# EAGLE design Qwiic_Weather (EAGLE 9.4.2)
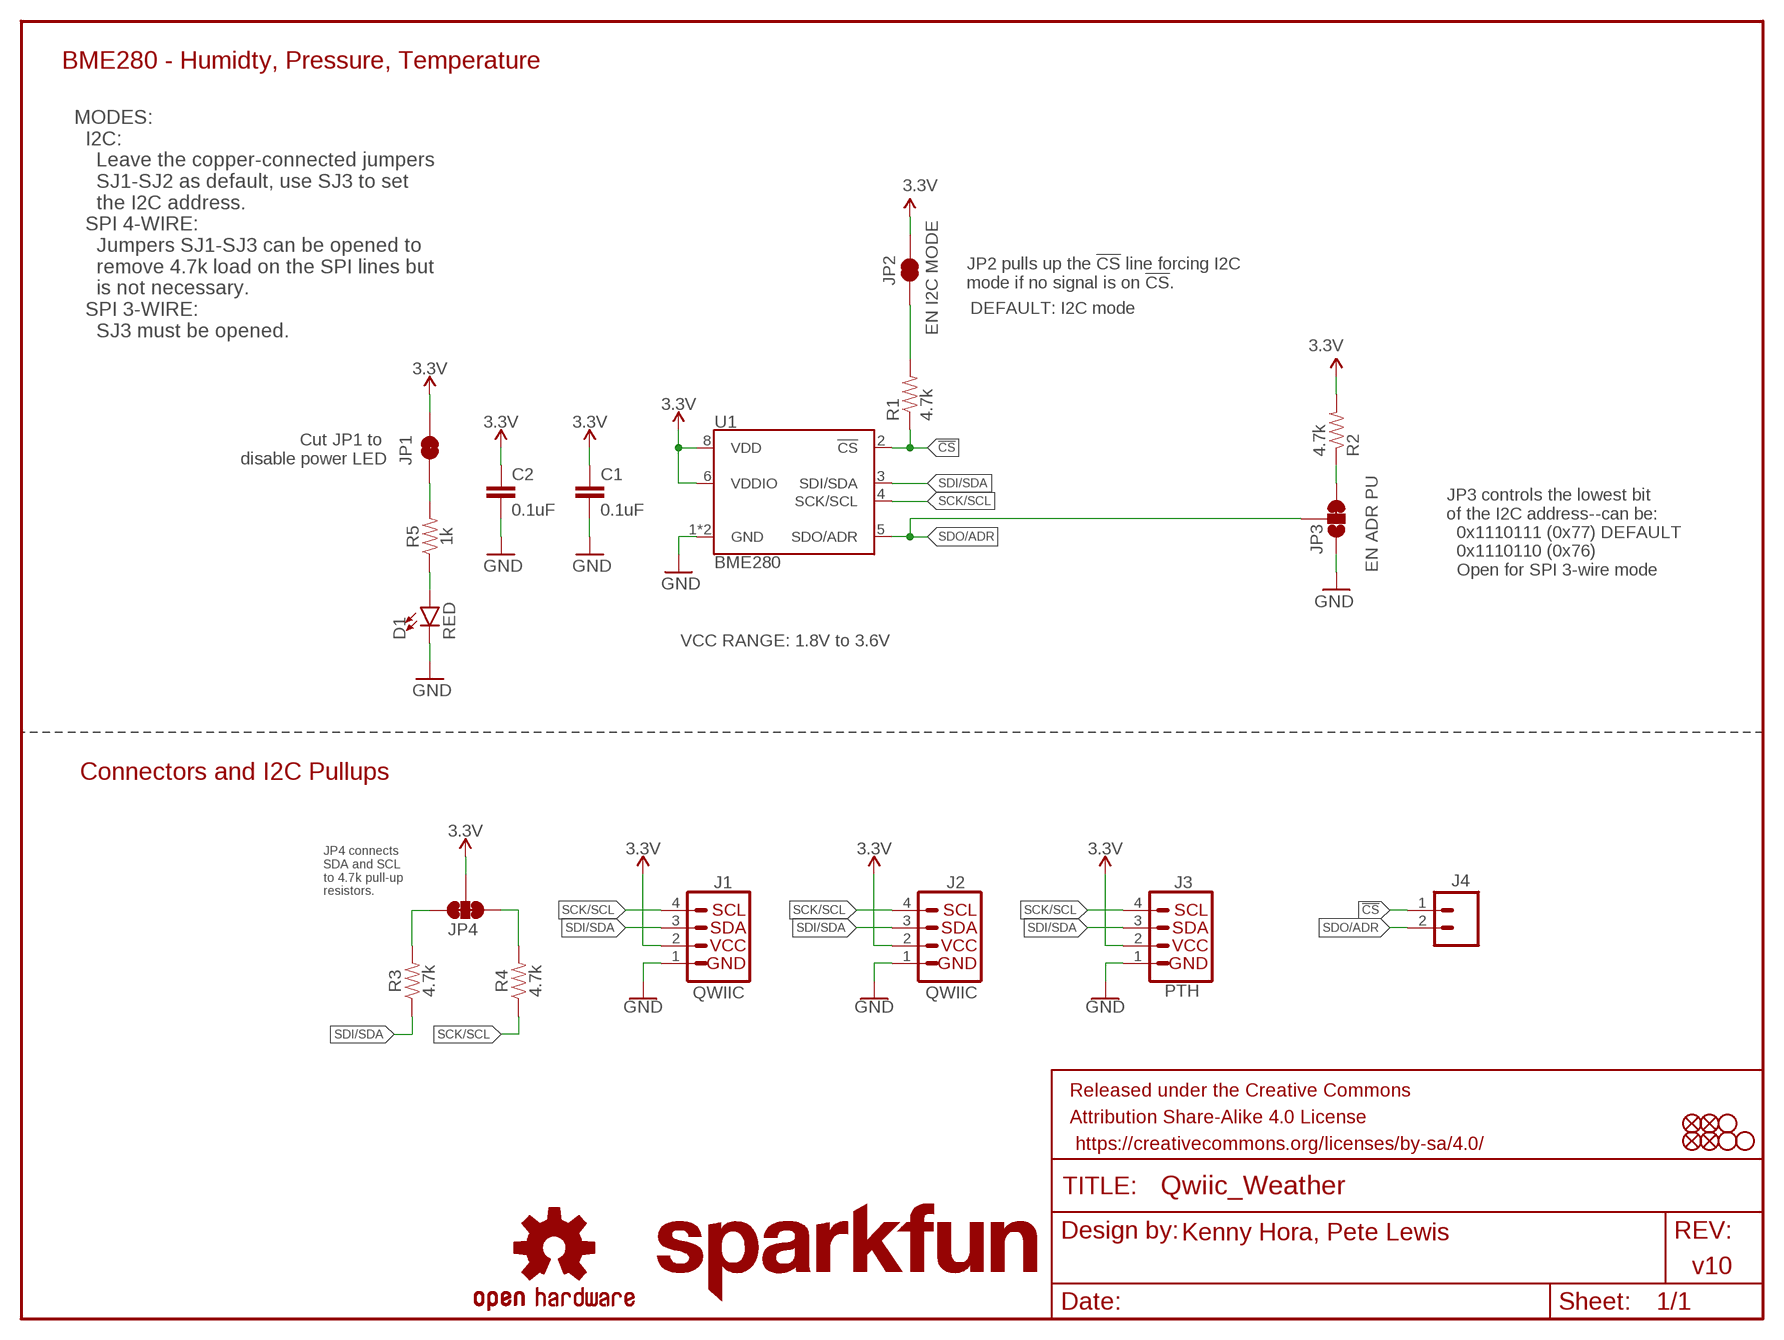
[diagram p0: schematic, sheet 1]

## Parts
C1  0.1uF  0.1UF-0603-25V-(+80/-20%)  [0603]
C2  0.1uF  0.1UF-0603-25V-(+80/-20%)  [0603]
D1  RED  LED-RED0603  [LED-0603]
FD1  FIDUCIAL1X2  [FIDUCIAL-1X2]
FD2  FIDUCIAL1X2  [FIDUCIAL-1X2]
FD3  FIDUCIAL1X2  [FIDUCIAL-1X2]
FD4  FIDUCIAL1X2  [FIDUCIAL-1X2]
FRAME1  FRAME-LETTER  [CREATIVE_COMMONS]
H1  STAND-OFF  [STAND-OFF]
H2  STAND-OFF  [STAND-OFF]
H4  STAND-OFF  [STAND-OFF]
J1  QWIIC  I2C_STANDARDQWIIC  [JST04_1MM_RA]
J2  QWIIC  I2C_STANDARDQWIIC  [JST04_1MM_RA]
J3  PTH  I2C_STANDARD_NO_SILK  [1X04_NO_SILK]
J4  CONN_021X02_NO_SILK  [1X02_NO_SILK]
JP1  JUMPER-SMT_2_NC_TRACE_NO-SILK  [SMT-JUMPER_2_NC_TRACE_NO-SILK]
JP2  EN I2C MODE  JUMPER-PAD-2-NC_BY_TRACENO_SILK  [PAD-JUMPER-2-NC_BY_TRACE_NO_SILK]
JP3  EN ADR PU  JUMPER-SMT_3_1-NC_TRACE_NO-SILK  [SMT-JUMPER_3_1-NC_TRACE_NO-SILK]
JP4  JUMPER-SMT_3_2-NC_TRACE_NO-SILK  [SMT-JUMPER_3_2-NC_TRACE_NO-SILK]
LOGO1  SFE_LOGO_NAME.1_INCH  [SFE_LOGO_NAME_.1]
LOGO4  OSHW-LOGOS  [OSHW-LOGO-S]
R1  4.7k  4.7KOHM-0603-1/10W-1%  [0603]
R2  4.7k  4.7KOHM-0603-1/10W-1%  [0603]
R3  4.7k  4.7KOHM-0603-1/10W-1%  [0603]
R4  4.7k  4.7KOHM-0603-1/10W-1%  [0603]
R5  1k  1KOHM-0603-1/10W-1%  [0603]
U1  BME280  [LGA-8-2.5X2.5]

## Nets
3.3V: C1.1 C2.1 J1.2 J2.2 J3.2 JP1.2 JP2.2 JP4.2 R2.2 U1.6(VDDIO) U1.8(VDD)
!CS: J4.1 R1.1 U1.2(!CS)
GND: C1.2 C2.2 D1.C J1.1 J2.1 J3.1 JP3.1 U1.1(GND) U1.7(GND)
N$2: JP3.3 R2.1
N$3: D1.A R5.1
N$4: JP4.3 R3.2
N$5: JP4.1 R4.2
N$6: JP2.1 R1.2
N$7: JP1.1 R5.2
SCK/SCL: J1.4 J2.4 J3.4 R4.1 U1.4(SCK/SCL)
SDI/SDA: J1.3 J2.3 J3.3 R3.1 U1.3(SDI/SDA)
SDO/ADR: J4.2 JP3.2 U1.5(SDO/ADR)

## Notes on the sheet
- BME280 - Humidty, Pressure, Temperature
- MODES:
    I2C:
      Leave the copper-connected jumpers
      SJ1-SJ2 as default, use SJ3 to set
      the I2C address.
    SPI 4-WIRE:
      Jumpers SJ1-SJ3 can be opened to 
      remove 4.7k load on the SPI lines but
      is not necessary.
    SPI 3-WIRE:
      SJ3 must be opened.
- JP2 pulls up the !CS! line forcing I2C
  mode if no signal is on !CS!.
- DEFAULT: I2C mode
- Cut JP1 to 
  disable power LED
- JP3 controls the lowest bit
  of the I2C address--can be:
    0x1110111 (0x77) DEFAULT
    0x1110110 (0x76)
    Open for SPI 3-wire mode
- VCC RANGE: 1.8V to 3.6V
- Connectors and I2C Pullups
- JP4 connects 
  SDA and SCL 
  to 4.7k pull-up 
  resistors.
- Kenny Hora, Pete Lewis
- v10

## Library data of the parts
C1 C2 = SparkFun-Capacitors:0.1UF: 0.1µF ceramic capacitors A capacitor is a passive two-terminal electrical component used to store electrical energy temporarily in an electric field.; PROD_ID: CAP-00810
D1 = SparkFun-LED:LED-RED: Red SMD LED Used in manufacturing of most products at SparkFun Packages: 0603 - SMD 0603 package [Product Link] <http://docs.avagotech.com/docs/AV02-0551EN> 0603 SMART - SMD 0603 SMART package ( more efficient and expensive)[Product Link] <http://www.osram-os.com/Graphics/XPic2/00077099_0.pdf> 1206 - SMD1206 package [Product Link] <https://www.sparkfun.com/datasheets/DevTools/LilyPad/Q150OVS4.pdff> SparkFun Products: Pro Mini 328 -5V <https://www.sparkfun.com/products/821> RedBoard <https://www.sparkfun.com/products/12757> IOIO-OTG <https://www.sparkfun.com/products/13613>; PROD_ID: DIO-00819
FD1-FD4 = SparkFun-Aesthetics:FIDUCIAL: Fiducial Alignment Points Point-of-reference for pick-and-place machines and other optical instruments.
FRAME1 = SparkFun-Aesthetics:FRAME-LETTER: Schematic Frame - Letter Standard 8.5x11 US Letter frame
H1 H2 H4 = SparkFun-Hardware:STAND-OFF: Stand Off Drill holes for mechanically mounting via screws, standoffs, etc. Note: Use the keepout ring to avoid running the screw head into surrounding components. Variant Overviews STAND-OFF - Mechanical footprint for a #4 phillips button head screw. STAND-OFF-TIGHT - Mechanical footprint for a #4 phillips button head screw, Example SparkFun Products Screw - Phillips Head (1/4", 4-40, 10 pack) <https://www.sparkfun.com/products/10453> (PRT-10453) Screw - Phillips Head (1/2", 4-40, 10 pack) <https://www.sparkfun.com/products/10452> (PRT-10452) Screw - Phillips Head (3/4", 4-40, 10 pack) <https://www.sparkfun.com/products/10451> (PRT-10451) Screw - Phillips Head (1", 4-40, 10 pack) <https://www.sparkfun.com/products/10450> (PRT-10450)
J1 J2 = SparkFun-Connectors:I2C_STANDARD: SparkFun I2C Standard Pinout Header SparkFun has standardized on a pinout for all I2C based sensor breakouts. This pinout allows I2C boards to be plugged directly into the headers on Arduino Uno compatible boards, and to be daisy chained easily. Example SparkFun Products: SparkFun Atmospheric Sensor Breakout - BME280 <https://www.sparkfun.com/products/13676> SparkFun Altitude/Pressure Sensor Breakout - MPL3115A2 <https://www.sparkfun.com/products/11084> SparkFun TOF Range Finder Sensor - VL6180 <https://www.sparkfun.com/products/12785>; PROD_ID: CONN-13694; VALUE: Qwiic Right Angle
J3 = SparkFun-Connectors:I2C_STANDARD: SparkFun I2C Standard Pinout Header SparkFun has standardized on a pinout for all I2C based sensor breakouts. This pinout allows I2C boards to be plugged directly into the headers on Arduino Uno compatible boards, and to be daisy chained easily. Example SparkFun Products: SparkFun Atmospheric Sensor Breakout - BME280 <https://www.sparkfun.com/products/13676> SparkFun Altitude/Pressure Sensor Breakout - MPL3115A2 <https://www.sparkfun.com/products/11084> SparkFun TOF Range Finder Sensor - VL6180 <https://www.sparkfun.com/products/12785>
J4 = SparkFun-Connectors:CONN_02: Multi connection point. Often used as Generic Header-pin footprint for 0.1 inch spaced/style header connections On any of the 0.1 inch spaced packages, you can populate with these: Break Away Headers - Straight <https://www.sparkfun.com/products/116> (PRT-00116) Break Away Male Headers - Right Angle <https://www.sparkfun.com/products/553> (PRT-00553) Female Headers <https://www.sparkfun.com/products/115> (PRT-00115) Break Away Headers - Machine Pin <https://www.sparkfun.com/products/117> (PRT-00117) Break Away Female Headers - Swiss Machine Pin <https://www.sparkfun.com/products/743> (PRT-00743) For SCREWTERMINALS and SPRING TERMINALS visit here: Screw Terimnals on SparkFun.com <https://www.sparkfun.com/search/results?term=Screw+Terminals> (5mm/3.5mm/2.54mm spacing) This device is also useful as a general connection point to wire up your design to another part of your project. Our various solder wires solder well into these plated through hole pads. Hook-Up Wire - Assortment (Stranded, 22 AWG) <https://www.sparkfun.com/products/11375> (PRT-11375) Hook-Up Wire - Assortment (Solid Core, 22 AWG) <https://www.sparkfun.com/products/11367> (PRT-11367) View the entire wire category on our website here <https://www.sparkfun.com/categories/141> Special notes: Molex polarized connector foot print use with: PRT-08233 with associated crimp pins and housings. 2.54_SCREWTERM for use with PRT-10571. 3.5mm Screw Terminal footprints for PRT-08084 5mm Screw Terminal footprints for use with PRT-08432
JP1 = SparkFun-Jumpers:JUMPER-SMT_2_NC_TRACE: Normally closed trace jumper This jumper has a trace between two pads so it's normally closed (NC). Use a razor knife to open the connection. For best results follow the IPC guidelines for cutting traces: Cutout at least 0.063 mm (0.005 in). Remove all loose material to clean up the cut area. Seal the cut with an approved epoxy. Reapply solder to reclose the connection.
JP2 = SparkFun-Passives:JUMPER-PAD-2-NC_BY_TRACE
JP3 = SparkFun-Jumpers:JUMPER-SMT_3_1-NC_TRACE: Normally closed trace jumper (1 of 2 connections) This jumper has a trace between two pads so it's normally closed (NC). The other connection is normally open (NO). Use a razor knife to open the connection. For best results follow the IPC guidelines for cutting traces: Cutout at least 0.063 mm (0.005 in). Remove all loose material to clean up the cut area. Seal the cut with an approved epoxy. Reapply solder to reclose the connection, or to close the NO connection.
JP4 = SparkFun-Jumpers:JUMPER-SMT_3_2-NC_TRACE: Normally closed trace jumper (2 of 2 connections) This jumper has a trace between all three pads so they are normally closed (NC). Use a razor knife to open the connection(s). For best results follow the IPC guidelines for cutting traces: Cutout at least 0.063 mm (0.005 in). Remove all loose material to clean up the cut area. Seal the cut with an approved epoxy. Reapply solder to reclose the connection(s).
LOGO1 = SparkFun-Aesthetics:SFE_LOGO_NAME: SparkFun Font Logo This is the SparkFun name logo. The logo on the schematic will always be the same size; the package variant is the height of the flame part of the logo (or the height the flame would be, if it were drawn). Default layer for the logo on the board is tSilk.
LOGO4 = SparkFun-Aesthetics:OSHW-LOGO: Open-Source Hardware (OSHW) Logo This logo indicates the piece of hardware it is found on incorporates a OSHW license and/or adheres to the definition of open source hardware found here: http://freedomdefined.org/OSHW
R1-R4 = SparkFun-Resistors:4.7KOHM: 4.7kΩ resistor A resistor is a passive two-terminal electrical component that implements electrical resistance as a circuit element. Resistors act to reduce current flow, and, at the same time, act to lower voltage levels within circuits. - Wikipedia; PROD_ID: RES-07857
R5 = SparkFun-Resistors:1KOHM: 1kΩ resistor A resistor is a passive two-terminal electrical component that implements electrical resistance as a circuit element. Resistors act to reduce current flow, and, at the same time, act to lower voltage levels within circuits. - Wikipedia; PROD_ID: RES-07856
U1 = SparkFun-Sensors:BME280: Bosch BME280 – Combined Humidity and Pressure Sensor The BME280 is as combined digital humidity, pressure and temperature sensor based on proven sensing principles. The sensor module is housed in an extremely compact metal-lid LGA package with a footprint of only 2.5×2.5mm² with a height of 0.93mm. Its small dimensions and its low power consumption allow the implementation in battery driven devices such as handsets, GPS modules or watches. Datasheet <https://cdn.sparkfun.com/assets/learn_tutorials/4/1/9/BST-BME280_DS001-10.pdf> SparkFun Products SparkFun Atmospheric Sensor Breakout - BME280 <https://www.sparkfun.com/products/13676> (SEN-13676); PROD_ID: IC-13090

## Board
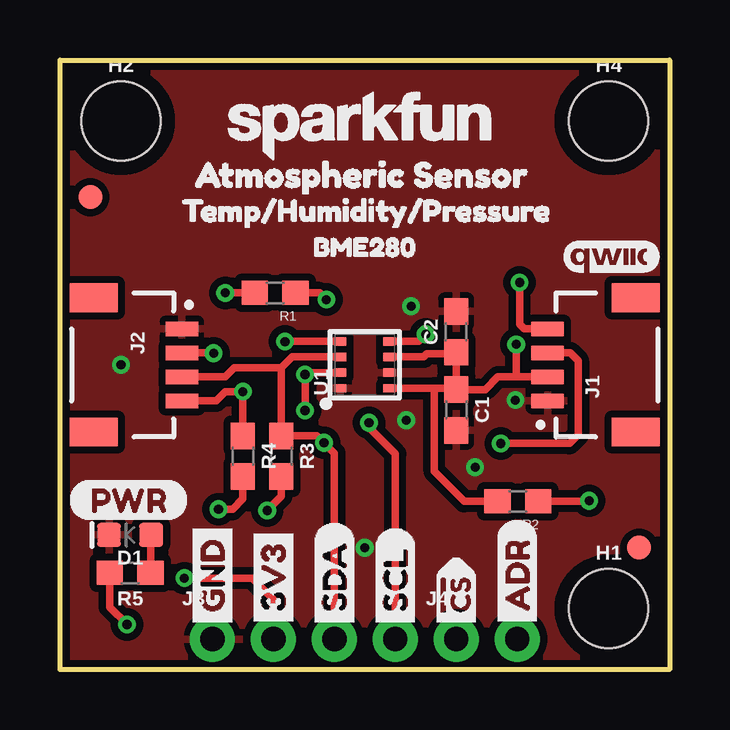
[diagram p1: board, top side]
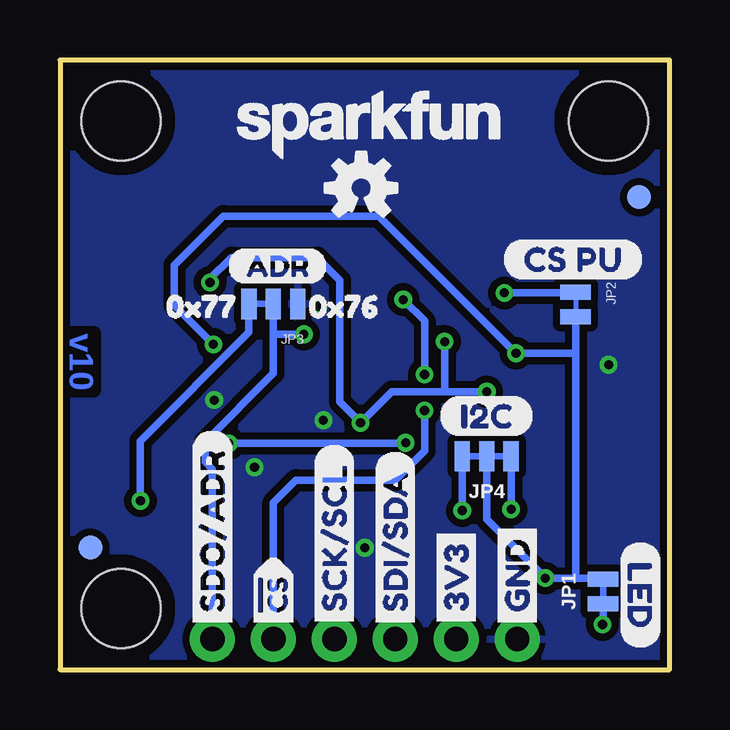
[diagram p2: board, bottom side, seen from below]

Size 25.4 x 25.4 mm. Coordinates in mm from the lower left corner, seen from the top.
Outline: 0,0 0,25.4 25.4,25.4 25.4,0 0,0
Copper layers (1*16): Top 0.035mm / dielectric 1.5mm / Bottom 0.035mm
Design rules "SparkFun-2-layer-TIGHT": minimum track width 7mil, minimum drill 15mil, track to track 7mil, track to pad 7mil, pad to pad 7mil, via to via 7mil, smd to smd 7mil, copper to edge 7mil, drill to drill 7mil, minimum pad ring 7mil, minimum via ring 7mil, stop-mask expansion 4mil, vias tented up to drill 25mil, thermal gap 10mil

### Footprints (pad centres in the part's own frame; a part is rotated, then mirrored left to right if it is on the bottom)
0603 = smd 1.1 x 1: 1 -0.85,0; 2 0.85,0
LED-0603 = smd 1 x 1: A -0.877,0; C 0.877,0
FIDUCIAL-1X2 = smd 1 x 1: 1 0,0
STAND-OFF = hole 3.302: 0,0
JST04_1MM_RA = smd 0.6 x 1.35: 1 -1.5,0; 2 -0.5,0; 3 0.5,0; 4 1.5,0 | smd 1.2 x 2: NC1 2.8,-3.675; NC2 -2.8,-3.675
1X04_NO_SILK = drill 1.016 pad 1.88: 1 0,0; 2 2.54,0; 3 5.08,0; 4 7.62,0
1X02_NO_SILK = drill 1.016 pad 1.88: 1 0,0; 2 2.54,0
SMT-JUMPER_2_NC_TRACE_NO-SILK = smd 0.635 x 1.27: 1 -0.508,0; 2 0.508,0
PAD-JUMPER-2-NC_BY_TRACE_NO_SILK = smd 0.635 x 1.27: 1 -0.508,0; 2 0.508,0
SMT-JUMPER_3_1-NC_TRACE_NO-SILK = smd 0.635 x 1.27: 1 -1.016,0; 2 0,0; 3 1.016,0
SMT-JUMPER_3_2-NC_TRACE_NO-SILK = smd 0.635 x 1.27: 1 -1.016,0; 2 0,0; 3 1.016,0
LGA-8-2.5X2.5 = smd 0.35 x 0.5: 1 -0.975,1.025; 2 -0.325,1.025; 3 0.325,1.025; 4 0.975,1.025; 5 0.975,-1.025; 6 0.325,-1.025; 7 -0.325,-1.025; 8 -0.975,-1.025

### Placement (x,y rotation side)
C1  16.51,10.82 270 top
C2  16.51,14.07 90 top
D1  2.92,5.61 180 top
FD1  1.27,19.68 0 top
FD2  24.13,5.08 0 top
FD3  24.13,5.08 0 bottom
FD4  1.27,19.68 0 bottom
FRAME1  -13.97,-21.59 0 top  (outside the outline)
H1  22.86,2.54 0 top
H2  2.54,22.86 0 top
H4  22.86,22.86 0 top
J1  20.32,12.7 90 top
J2  5.08,12.7 270 top
J3  6.35,1.27 0 top
J4  16.51,1.27 0 top
JP1  2.77,3.25 90 bottom
JP2  3.91,15.21 270 bottom
JP3  16.51,15.24 180 bottom
JP4  7.62,8.89 180 bottom
LOGO1  12.5,22.65 0 top
LOGO3  SFE_LOGO_NAME.1_INCH  [SFE_LOGO_NAME_.1@1]  18.49,20.8 0 bottom
LOGO4  12.85,20.07 0 bottom
R1  8.97,15.7 180 top
R2  19.08,7.01 180 top
R3  9.22,8.89 270 top
R4  7.62,8.89 270 top
R5  2.92,4.04 180 top
U1  12.7,12.7 90 top
U$1  [LED0]  1.22,5.41 270 bottom
U$2  [3V34]  8.89,1.5 90 top
U$3  [ADR8]  19.05,1.5 90 top
U$4  [GND3]  6.35,1.5 90 top
U$5  [SDA5]  11.43,1.5 90 top
U$6  [SCL6]  13.97,1.5 90 top
U$7  [3V34]  8.89,1.5 90 bottom
U$8  [GND3]  6.35,1.5 90 bottom
U$9  [SDI#SDA11]  11.43,1.5 90 bottom
U$10  [SDO#ADR9]  19.05,1.5 90 bottom
U$11  [SCK#SCL10]  13.97,1.5 90 bottom
U$13  [PWR0]  0.36,7.06 0 top
U$14  [#CS0]  16.51,1.3 90 top
U$15  [BME2804]  9.88,17.6 0 top
U$16  [QWIIC_4MM]  22.99,17.2 0 top
U$17  [ATMOSPHERIC_SENSOR0]  4.72,20.62 0 top
U$18  [ADR2]  18.47,16.81 0 bottom
U$19  [0X771]  21.77,15.14 0 bottom
U$20  [0X760]  15.82,15.14 0 bottom
U$21  [CS_PU1]  7.01,17.09 0 bottom
U$22  [I2C0]  9.65,10.57 0 bottom
U$23  [TEMP#HUMIDITY#PRESSURE0]  4.29,19.13 0 top
U$24  [#CS0]  16.51,1.3 90 bottom

### Tracks (layer width: path | path; a pad name or v marks a point on that pad's centre or on a via)
3.3V  (via drill 0.38)
  Top 0.305: 19.02,12.2 18.25,12.2 17.72,11.67 C1.1 | 19.02,12.2 J1.2 | U1.6 15.16,13.03 15.29,13.16 16.45,13.16 C2.1 C1.1 | v5.18,3.81 8,3.81 8.89,2.92 J3.2 | 15.6,11.72 16.45,11.72 C1.1 | R2.2 16.84,7.01 15.6,8.26 15.6,11.72 | v19.01,13.55 19.01,12.21 19.02,12.2 | J2.2 6.38,13.2 v6.4,13.18 | U1.8 15.6,11.72
  Bottom 0.305: v19.01,13.55 20.64,15.18 20.64,16.85 18.59,18.9 12.12,18.9 v6.4,13.18 3.91,13.18 | JP2.2 3.91,13.18 | JP4.2 7.62,6.27 5.18,3.83 v5.18,3.81 3.91,3.81 | 3.91,3.81 2.82,3.81 JP1.2 | 3.91,13.18 3.91,3.81
!CS  (via drill 0.38)
  Top 0.305: U1.2 10.29,12.38 v10.21,12.29 v10.21,10.79 | R1.1 10.82,15.7 v11.1,15.42
  Bottom 0.305: v10.21,12.29 10.21,14.53 v11.1,15.42 | J4.1 16.51,6.96 15.57,7.9 11.43,7.9 10.21,9.12 v10.21,10.79
GND  (via drill 0.38)
  other vias: 12.7,5.08 18.97,11.23 14.63,15.14 2.54,12.7 14.43,10.39 17.3,8.43
  pour Top (isolate 0.305): 0,0 25.4,0 25.4,25.4 0,25.4
  pour Bottom (isolate 0.305): 0,25.4 25.4,25.4 25.4,0 0,0
N$2  (via drill 0.38)
  Top 0.305: v22.05,7.04 22.02,7.01 R2.1
  Bottom 0.305: v22.05,7.04 22.05,9.53 17.53,14.05 JP3.3
N$3
  Top 0.305: R5.1 3.77,5.59 D1.A
N$4  (via drill 0.38)
  Top 0.305: R3.2 9.22,7.21 v8.64,6.63
  Bottom 0.305: JP4.3 v8.64,6.63
N$5  (via drill 0.38)
  Top 0.305: R4.2 7.62,7.11 7.19,6.68 v6.6,6.68
  Bottom 0.305: JP4.1 v6.6,6.68
N$6  (via drill 0.38)
  Top 0.305: R1.2 v6.88,15.7
  Bottom 0.305: JP2.1 3.94,15.7 v6.88,15.7
N$7  (via drill 0.38)
  Top 0.305: v2.79,1.88 2.07,2.6 R5.2
  Bottom 0.305: JP1.1 2.77,1.91 v2.79,1.88
SCK/SCL  (via drill 0.38)
  Top 0.305: J2.4 6.5,11.2 6.88,11.58 v7.62,11.58 R4.1 | U1.4 9.38,13.68 v9.37,13.66 | J3.4 13.97,8.99 12.88,10.08 v12.88,10.29 | J1.4 19.35,14.2 19.15,14.4 v19.15,16.13
  Bottom 0.305: v19.15,16.13 19.15,16.28 18.26,17.17 14.68,17.17 13.74,16.23 13.74,11.15 v12.88,10.29 11.58,11.58 9.35,11.58 | v7.62,11.58 9.35,11.58 | v9.37,13.66 9.37,11.61 9.35,11.58
SDI/SDA  (via drill 0.38)
  Top 0.305: J3.3 11.43,9.02 v11,9.45 10.71,9.74 R3.1 9.22,12.58 | J1.3 21.27,13.2 21.59,12.88 21.59,9.78 21.23,9.42 v18.36,9.42 | J2.3 6.89,12.2 7.27,12.58 9.22,12.58 | 9.22,12.58 9.67,13.03 U1.3
  Bottom 0.305: v18.36,9.42 11.02,9.42 v11,9.45
SDO/ADR  (via drill 0.38)
  Top 0.305: U1.5 14.95,13.68 v15.24,13.97
  Bottom 0.305: J4.2 19.05,8.36 19.36,8.66 19.36,9.5 16.51,12.34 16.51,13.97 | JP3.2 16.51,13.97 | v15.24,13.97 16.51,13.97

### Text on the board
Bottom: v10
tDocu: Kenny Hora, Pete Lewis